# Altium schematic sheet device-inverter.SchDoc
size 297 x 209 mm
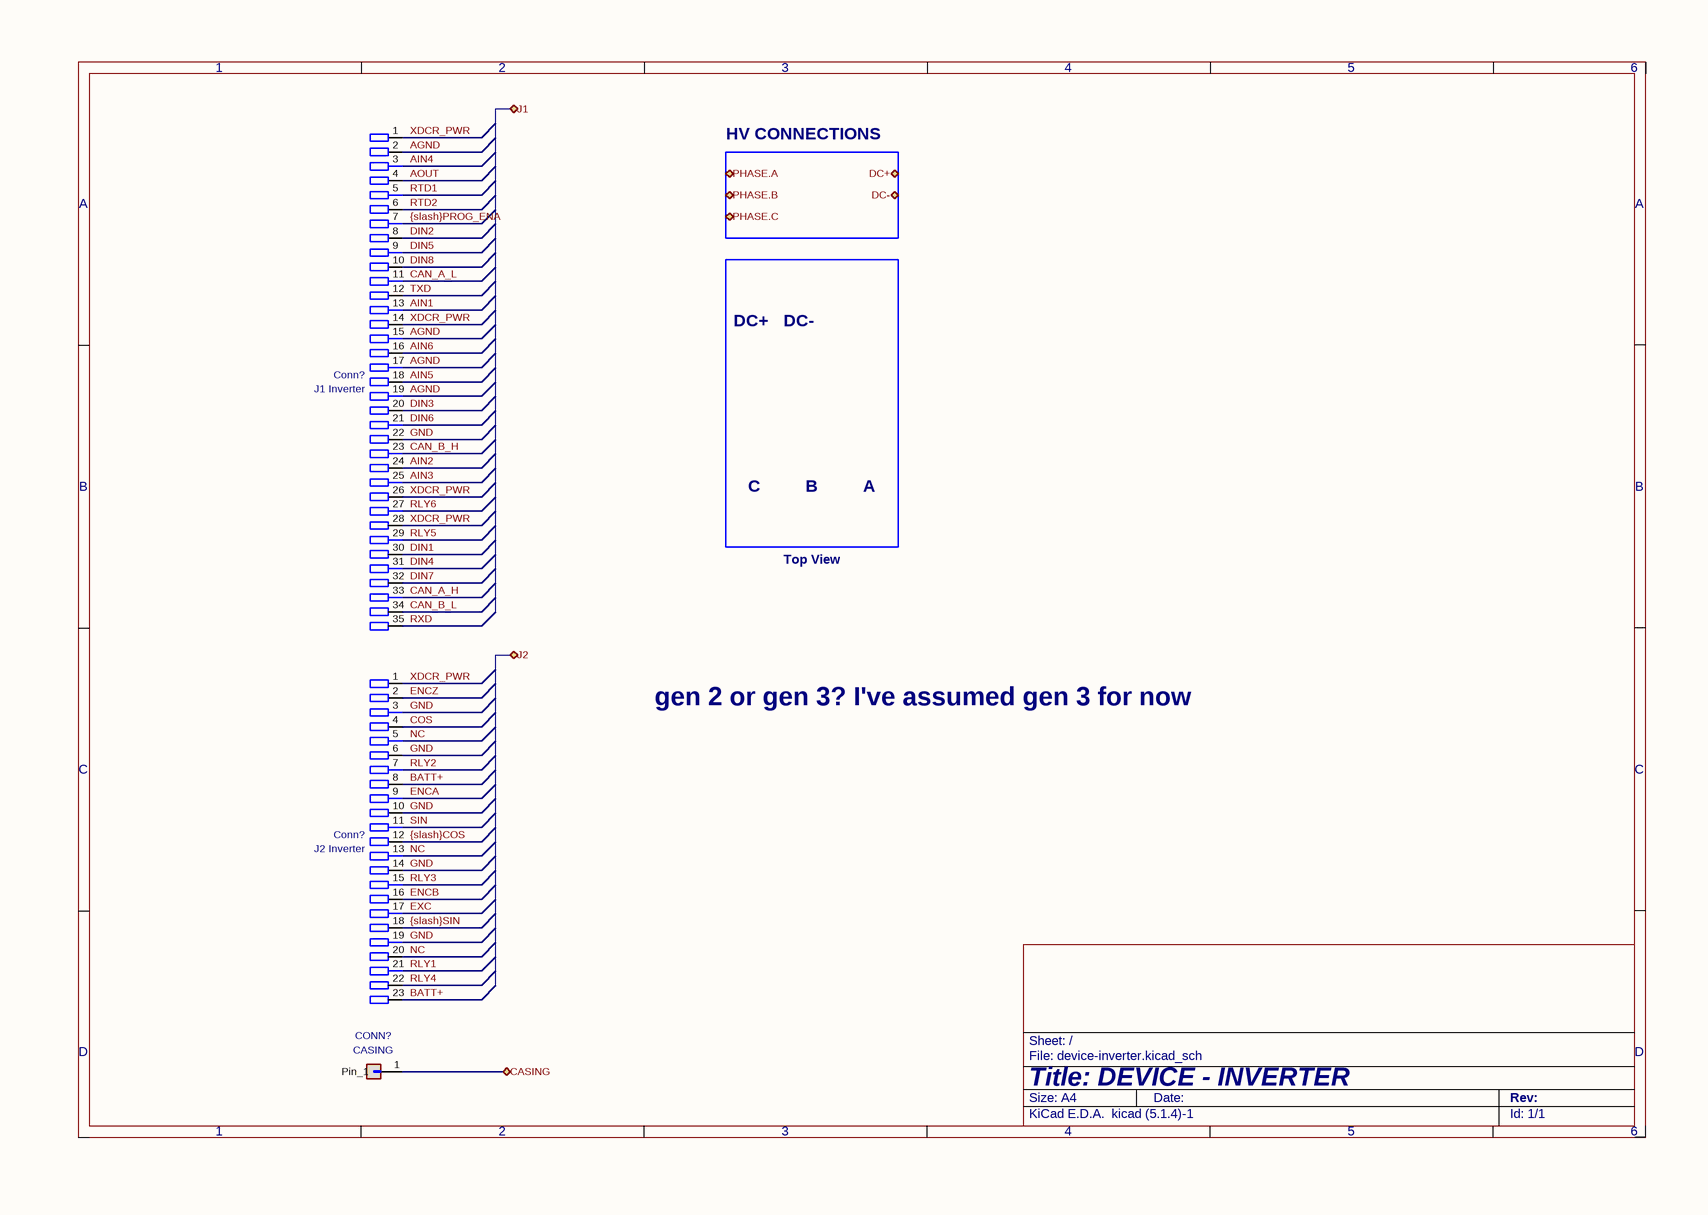
[diagram p0: device-inverter.SchDoc]

## Parts
(Parts that share a designator on the sheet are numbered #1, #2 ... from top to bottom, then left to right.)
Conn?#1  J1 Inverter
Conn?#2  J2 Inverter
CONN?#3  CASING

## Ports
CASING (bidir), DC+ (bidir), DC- (bidir), J1 (bidir), J2 (bidir), PHASE.A (bidir), PHASE.B (bidir), PHASE.C (bidir)

## Nets
AGND: Conn?#1.2 Conn?#1.15 Conn?#1.17 Conn?#1.19
AIN1: Conn?#1.13
AIN2: Conn?#1.24
AIN3: Conn?#1.25
AIN4: Conn?#1.3
AIN5: Conn?#1.18
AIN6: Conn?#1.16
AOUT: Conn?#1.4
BATT+: Conn?#2.8 Conn?#2.23
CAN_A_H: Conn?#1.33
CAN_A_L: Conn?#1.11
CAN_B_H: Conn?#1.23
CAN_B_L: Conn?#1.34
CASING: CONN?#3.1(Pin_1) ; port CASING
COS: Conn?#2.4
DIN1: Conn?#1.30
DIN2: Conn?#1.8
DIN3: Conn?#1.20
DIN4: Conn?#1.31
DIN5: Conn?#1.9
DIN6: Conn?#1.21
DIN7: Conn?#1.32
DIN8: Conn?#1.10
ENCA: Conn?#2.9
ENCB: Conn?#2.16
ENCZ: Conn?#2.2
EXC: Conn?#2.17
GND: Conn?#1.22 Conn?#2.3 Conn?#2.6 Conn?#2.10 Conn?#2.14 Conn?#2.19
NC: Conn?#2.5 Conn?#2.13 Conn?#2.20
RLY1: Conn?#2.21
RLY2: Conn?#2.7
RLY3: Conn?#2.15
RLY4: Conn?#2.22
RLY5: Conn?#1.29
RLY6: Conn?#1.27
RTD1: Conn?#1.5
RTD2: Conn?#1.6
RXD: Conn?#1.35
SIN: Conn?#2.11
TXD: Conn?#1.12
XDCR_PWR: Conn?#1.1 Conn?#1.14 Conn?#1.26 Conn?#1.28 Conn?#2.1
{slash}COS: Conn?#2.12
{slash}PROG_ENA: Conn?#1.7
{slash}SIN: Conn?#2.18

## Notes on the sheet
- HV CONNECTIONS
- DC+
- DC-
- C
- B
- A
- Top View
- gen 2 or gen 3?
  I've assumed gen 3 for now
- 1
- 2
- 3
- 4
- 5
- 6
- D
- Title: DEVICE - INVERTER
- File: device-inverter.kicad_sch
- Sheet: /
- KiCad E.D.A.  kicad (5.1.4)-1
- Size: A4
- Date:
- Rev:
- Id: 1/1

## Library data of the parts
CONN?#3 = Conn_01x01: Value: CASING
Conn?#1 = J1 Inverter: Value: J1 Inverter
Conn?#2 = J2 Inverter: Value: J2 Inverter